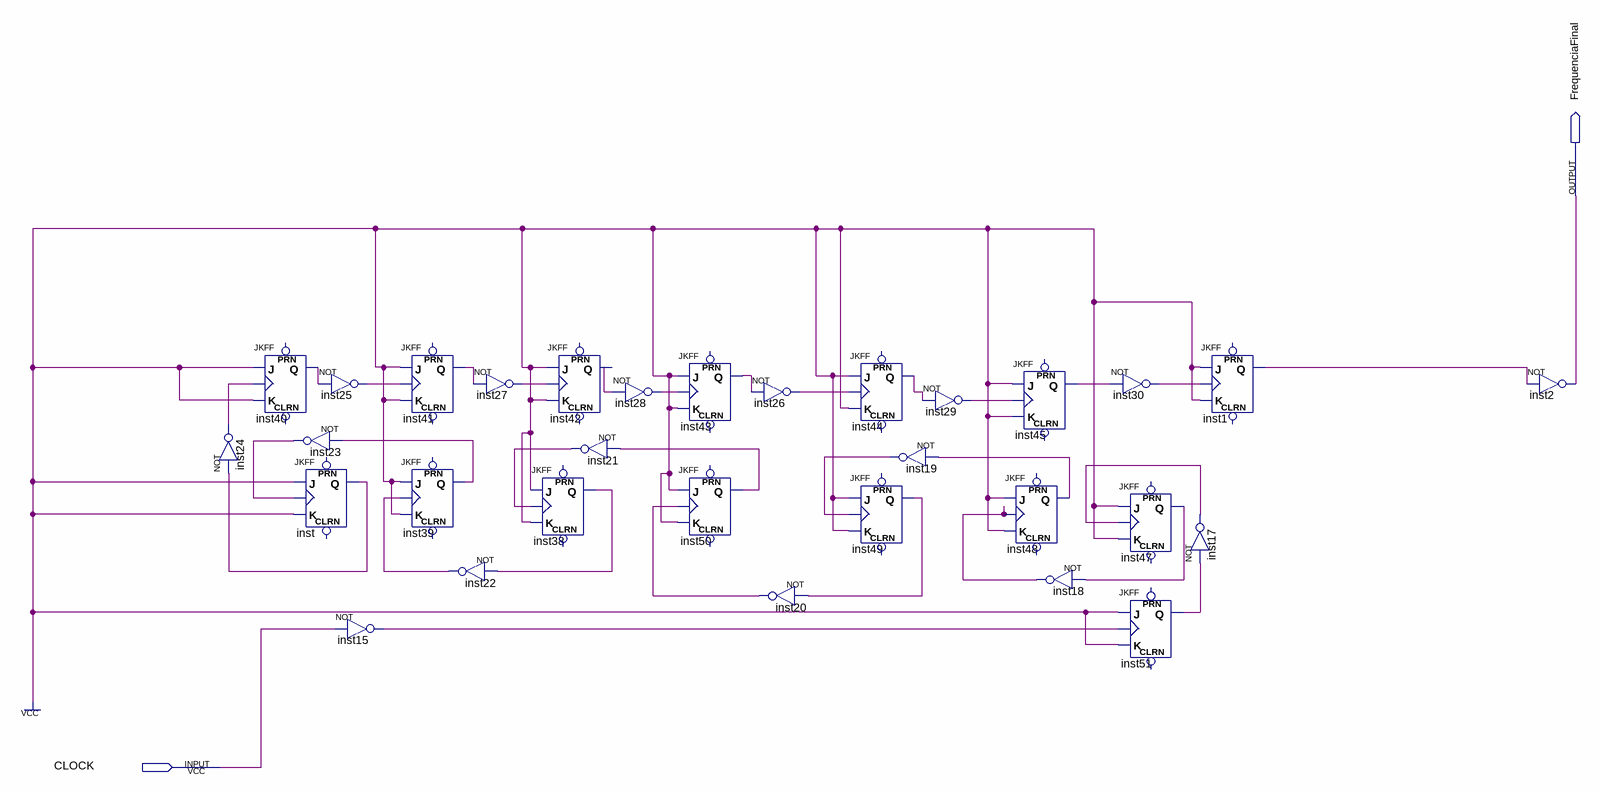
[diagram p0: schematic sheet]
// Quartus schematic DivisorFrequencia32768hz.bdf as structural Verilog: 31 symbols, 2 pins
module DivisorFrequencia32768hz (
  input  CLOCK,
  output FrequenciaFinal
);

  wire inst1_q, inst15_out, inst17_out, inst18_out, inst19_out, inst20_out, inst21_out, inst22_out,
       inst23_out, inst24_out, inst25_out, inst26_out, inst27_out, inst28_out, inst29_out, inst30_out,
       inst38_q, inst39_q, inst40_q, inst41_q, inst42_q, inst43_q, inst44_q, inst45_q, inst47_q, inst48_q,
       inst49_q, inst50_q, inst51_q, inst_q;

  not inst24 (inst24_out, inst_q);
  JKFF inst40 (.K(1'b1), .J(1'b1), .CLK(inst24_out), .Q(inst40_q));  // open: PRN, CLRN
  not inst25 (inst25_out, inst40_q);
  not inst23 (inst23_out, inst39_q);
  JKFF inst (.K(1'b1), .J(1'b1), .CLK(inst23_out), .Q(inst_q));  // open: PRN, CLRN
  not inst15 (inst15_out, CLOCK);
  JKFF inst41 (.K(1'b1), .J(1'b1), .CLK(inst25_out), .Q(inst41_q));  // open: PRN, CLRN
  JKFF inst39 (.K(1'b1), .J(1'b1), .CLK(inst22_out), .Q(inst39_q));  // open: PRN, CLRN
  not inst27 (inst27_out, inst41_q);
  not inst22 (inst22_out, inst38_q);
  JKFF inst38 (.K(1'b1), .J(1'b1), .CLK(inst21_out), .Q(inst38_q));  // open: PRN, CLRN
  JKFF inst42 (.K(1'b1), .J(1'b1), .CLK(inst27_out), .Q(inst42_q));  // open: PRN, CLRN
  not inst21 (inst21_out, inst50_q);
  not inst28 (inst28_out, inst42_q);
  JKFF inst43 (.K(1'b1), .J(1'b1), .CLK(inst28_out), .Q(inst43_q));  // open: PRN, CLRN
  JKFF inst50 (.K(1'b1), .J(1'b1), .CLK(inst20_out), .Q(inst50_q));  // open: PRN, CLRN
  not inst26 (inst26_out, inst43_q);
  not inst20 (inst20_out, inst49_q);
  JKFF inst44 (.K(1'b1), .J(1'b1), .CLK(inst26_out), .Q(inst44_q));  // open: PRN, CLRN
  JKFF inst49 (.K(1'b1), .J(1'b1), .CLK(inst19_out), .Q(inst49_q));  // open: PRN, CLRN
  not inst29 (inst29_out, inst44_q);
  not inst19 (inst19_out, inst48_q);
  JKFF inst45 (.K(1'b1), .J(1'b1), .CLK(inst29_out), .Q(inst45_q));  // open: PRN, CLRN
  JKFF inst48 (.K(1'b1), .J(1'b1), .CLK(inst18_out), .Q(inst48_q));  // open: PRN, CLRN
  not inst18 (inst18_out, inst47_q);
  not inst30 (inst30_out, inst45_q);
  JKFF inst47 (.K(1'b1), .J(1'b1), .CLK(inst17_out), .Q(inst47_q));  // open: PRN, CLRN
  JKFF inst51 (.K(1'b1), .J(1'b1), .CLK(inst15_out), .Q(inst51_q));  // open: PRN, CLRN
  not inst17 (inst17_out, inst51_q);
  JKFF inst1 (.K(1'b1), .J(1'b1), .CLK(inst30_out), .Q(inst1_q));  // open: PRN, CLRN
  not inst2 (FrequenciaFinal, inst1_q);
endmodule
